# EAGLE design 01072016wearable_v1.3 - OK (EAGLE 7.6.0)
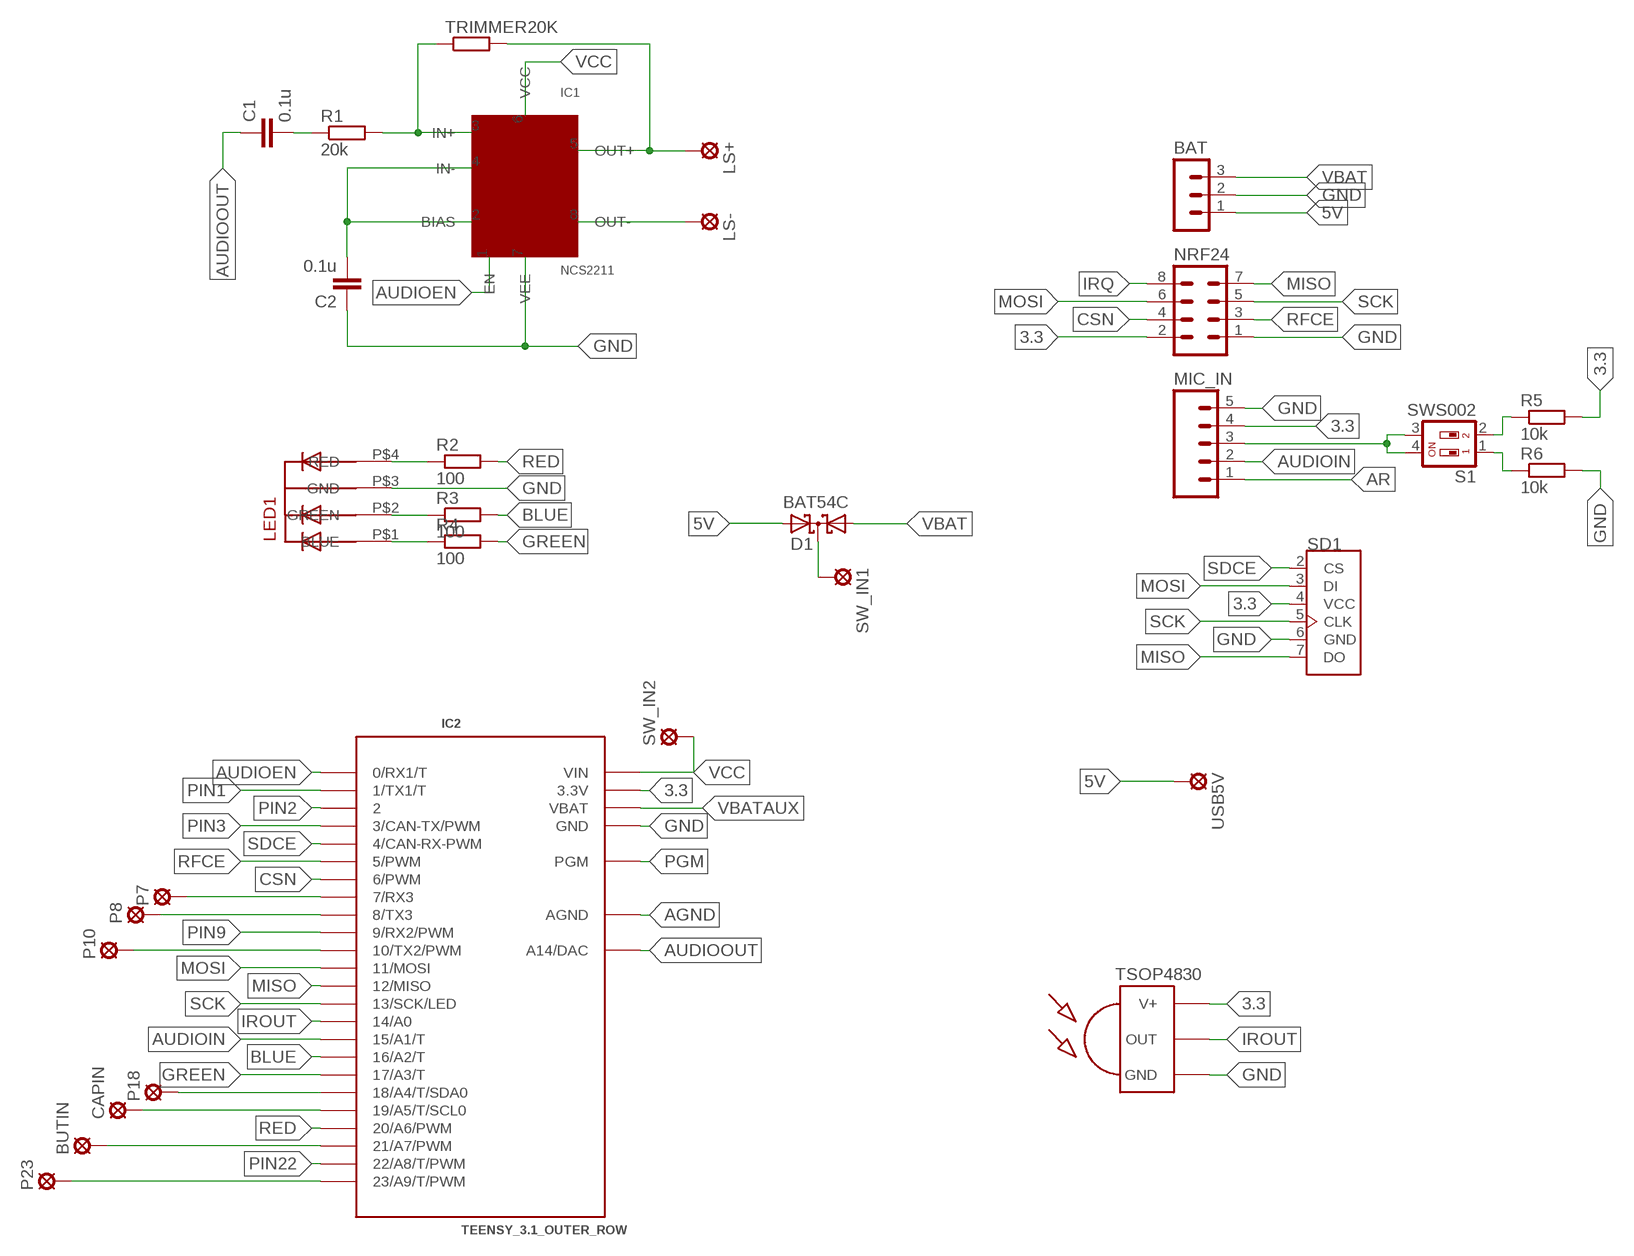
[diagram p0: schematic, sheet 1]

## Parts
BAT  MA03-1  [MA03-1]
BUTIN  LSP10  [LSP10]
C1  0.1u  C2.5/2  [C2.5-2]
C2  0.1u  C2.5/2  [C2.5-2]
CAPIN  LSP10  [LSP10]
D1  BAT54C  [SOT23]
IC1  NCS2211  [SOIC-8]
IC2  TEENSY_3.1_OUTER_ROW  [TEENSY3-OUTER_ROW]
LED1  5MMRGBLED  [LED5MMRGB]
LS+  LSP10  [LSP10]
LS-  LSP10  [LSP10]
MIC_IN  MA05  [05PA]
NRF24  MA04-2  [MA04-2]
P7  LSP10  [LSP10]
P8  LSP10  [LSP10]
P10  LSP10  [LSP10]
P18  LSP10  [LSP10]
P23  LSP10  [LSP10]
R1  20k  R-EU_0204/7  [0204/7]
R2  100  R-EU_0207/2V  [0207/2V]
R3  100  R-EU_0207/2V  [0207/2V]
R4  100  R-EU_0207/2V  [0207/2V]
R5  10k  R-EU_0207/2V  [0207/2V]
R6  10k  R-EU_0207/2V  [0207/2V]
S1  SWS002  [SMS-002]
SD1  MICROSD_SF-MICROSD  [MICROSD_MICROSD]
SW_IN1  SE11  [SE11]
SW_IN2  SE11  [SE11]
TRIMMER20K  R-EU_0207/2V  [0207/2V]
U$1  TSOP4830  [TSOP18XX]
USB5V  LSP10  [LSP10]

## Nets
3.3 [3.3]: IC2.3.3V IC2.3.3V1(3.3V) MIC_IN.4 NRF24.2 R5.2 SD1.4(VCC) U$1.VCC(V+)
5V [3.3]: BAT.1 D1.2(A2) USB5V.MP
AGND: IC2.AGND
AR: MIC_IN.1
AUDIOEN: IC1.1(EN) IC2.0(0/RX1/T)
AUDIOIN: IC2.15/A1(15/A1/T) MIC_IN.2
AUDIOOUT: C1.1 IC2.RESET/DAC(A14/DAC)
BLUE: IC2.16/A2(16/A2/T) R3.2
CSN: IC2.6(6/PWM) NRF24.4
GAIN: MIC_IN.3 S1.3 S1.4
GND [GND]: BAT.2 C2.1 IC1.7(VEE) IC2.GND IC2.GND1(GND) LED1.P$3(GND) MIC_IN.5 NRF24.1 R6.2 SD1.6(GND) U$1.GND
GREEN: IC2.17/A3(17/A3/T) R4.2
IROUT: IC2.14/A0 U$1.OUT
IRQ: NRF24.8
MISO: IC2.12(12/MISO) NRF24.7 SD1.7(DO)
MOSI: IC2.11(11/MOSI) NRF24.6 SD1.3(DI)
N$1: D1.3(CC) SW_IN1.MP
N$2: IC1.5(OUT+) LS+.MP TRIMMER20K.2
N$3: IC1.3(IN+) R1.2 TRIMMER20K.1
N$4: C1.2 R1.1
N$5: C2.2 IC1.2(BIAS) IC1.4(IN-)
N$6: IC1.8(OUT-) LS-.MP
N$7: LED1.P$4(RED) R2.1
N$8: LED1.P$1(BLUE) R4.1
N$9: LED1.P$2(GREEN) R3.1
N$10: BUTIN.MP IC2.21/A7(21/A7/PWM)
N$11: R5.1 S1.2
N$12: R6.1 S1.1
PGM: IC2.PGM
PIN1: IC2.1(1/TX1/T)
PIN2: IC2.2
PIN3: IC2.3(3/CAN-TX/PWM)
PIN7: IC2.7(7/RX3) P7.MP
PIN8: IC2.8(8/TX3) P8.MP
PIN9: IC2.9(9/RX2/PWM)
PIN10: IC2.10(10/TX2/PWM) P10.MP
PIN18: IC2.18/A4(18/A4/T/SDA0) P18.MP
PIN19: CAPIN.MP IC2.19/A5(19/A5/T/SCL0)
PIN22: IC2.22/A8(22/A8/T/PWM)
PIN23: IC2.23/A9(23/A9/T/PWM) P23.MP
RED: IC2.20/A6(20/A6/PWM) R2.2
RFCE: IC2.5(5/PWM) NRF24.3
SCK: IC2.13(13/SCK/LED) NRF24.5 SD1.5(CLK)
SDCE: IC2.4(4/CAN-RX-PWM) SD1.2(CS)
VBAT [3.3]: BAT.3 D1.1(A1)
VBATAUX: IC2.VBAT
VCC: IC1.6(VCC) IC2.VIN SW_IN2.MP

## Library data of the parts
BAT = con-lstb:MA03-1: PIN HEADER; OC_FARNELL: unknown; OC_NEWARK: unknown
BUTIN CAPIN LS+ LS- P7 P8 P10 P18 P23 USB5V = solpad:LSP10: SOLDER PAD drill 1.0 mm, distributor Buerklin, 12H555
C1 C2 = capacitor-wima:C: CAPACITOR naming: grid - package width
D1 = diode:BAT54C: Schottky Diodes Source: Fairchild .. BAT54.pdf
IC1 = NCS2211:NCS2211
IC2 = Teensy_3_and_LC_Series_Boards_v1.1:TEENSY_3.1_OUTER_ROW: Footprint for Teensy 3.1 or 3.2 board using all pin connections on the outer perimeter
LED1 = led_rgb:5MMRGBLED
MIC_IN = con-amp-quick:MA05: AMP QUICK CONNECTOR; OC_FARNELL: unknown; OC_NEWARK: unknown
NRF24 = con-lstb:MA04-2: PIN HEADER; OC_FARNELL: unknown; OC_NEWARK: unknown
R1-R6 TRIMMER20K = rcl:R-EU_: RESISTOR, European symbol
S1 = smd-special:SWS002: SMD Dip Switch 2 pol.
SD1 = sd:MICROSD_SF-MICROSD
SW_IN1 SW_IN2 = solpad:SE11: SOLDER PAD RTM, drill 1,1mm, distributor Buerklin, 07F810
U$1 = tsop-1:TSOP4830: IR Receiver and Demodulator

## Net classes
0 default: width 0.61 mm, clearance 0.3 mm
1 GND: width 0.61 mm, clearance 0.3 mm
2 3.3: width 0.61 mm, clearance 0.3 mm

## Board
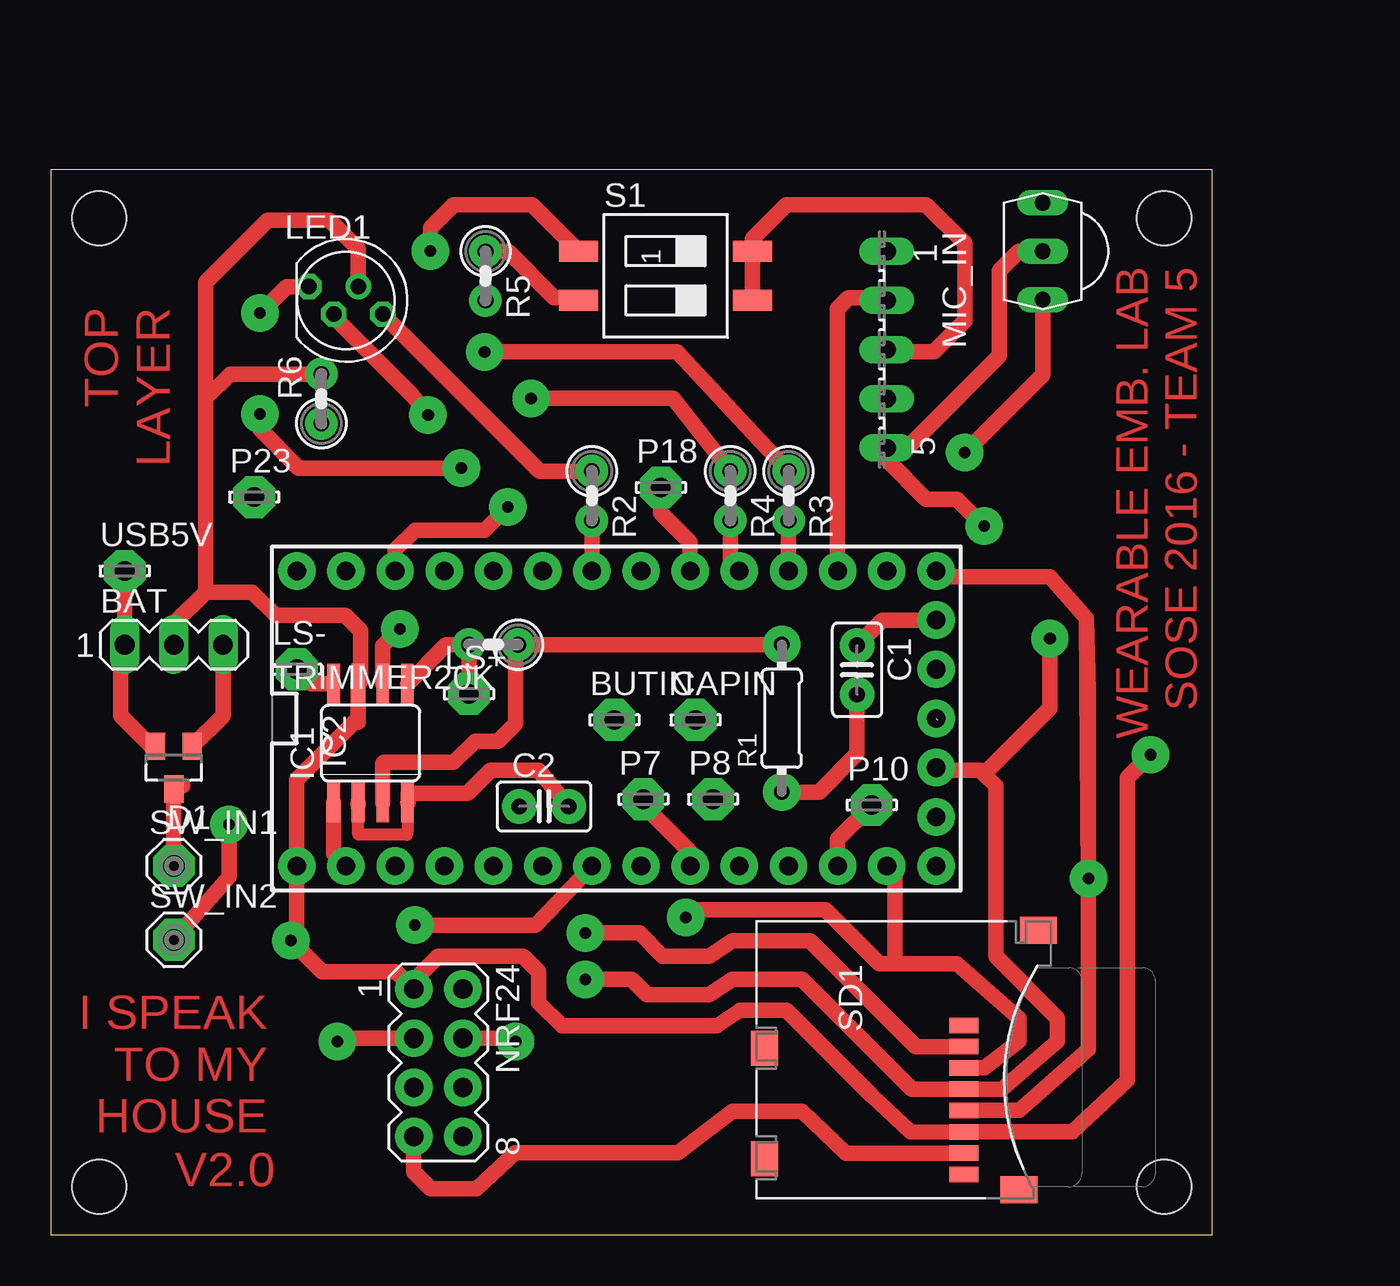
[diagram p1: board, top side]
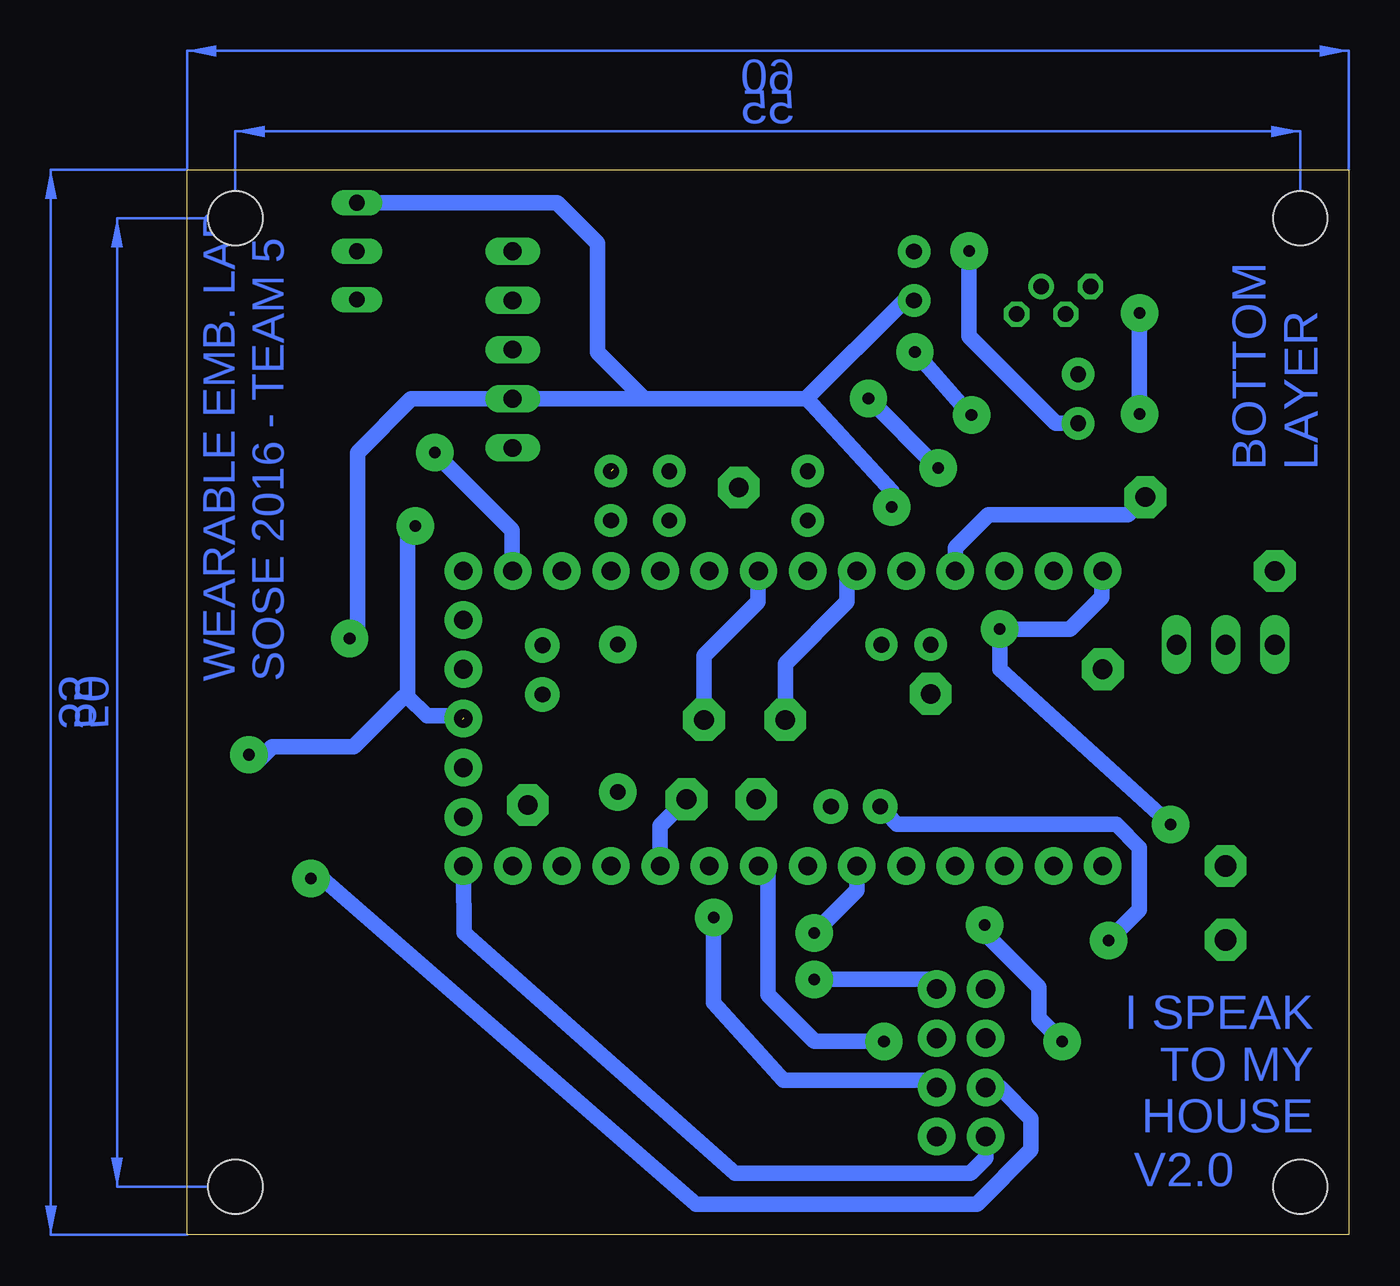
[diagram p2: board, bottom side, seen from below]

Size 60 x 55 mm. Coordinates in mm from the lower left corner, seen from the top.
Outline: 0,0 60,0 60,55 0,55 0,0
Copper layers (1*16): Top 0.035mm / dielectric 1.5mm / Bottom 0.035mm
Design rules "default *": minimum track width 10mil, minimum drill 24mil, track to track 0.2mm, track to pad 0.2mm, pad to pad 0.2mm, via to via 0.2mm, smd to smd 0.2mm, copper to edge 40mil, drill to drill 8mil, minimum pad ring 10mil, minimum via ring 8mil, stop-mask expansion 4mil, vias tented up to drill 0mil, thermal gap 10mil
Holes 2.8 mm at 2.5,2.5 2.5,52.5 57.5,52.5 57.5,2.5

### Footprints (pad centres in the part's own frame; a part is rotated, then mirrored left to right if it is on the bottom)
MA03-1 = drill 1.016 long: 1 -2.54,0; 2 0,0; 3 2.54,0
LSP10 = drill 1.016 pad 2.159 octagon: MP 0,0
C2.5-2 = drill 0.813 pad 1.778: 1 -1.27,0; 2 1.27,0
SOT23 = smd 1 x 1.4: 1 -0.95,-1.1; 2 0.95,-1.1; 3 0,1.1
SOIC-8 = smd 0.66 x 2.032: 1 -1.905,-3.073; 2 -0.635,-3.073; 3 0.635,-3.073; 4 1.905,-3.073; 5 1.905,3.073; 6 0.635,3.073; 7 -0.635,3.073; 8 -1.905,3.073
TEENSY3-OUTER_ROW = drill 0.965 pad 1.93: 0 -7.62,13.97; 1 -7.62,11.43; 2 -7.62,8.89; 3 -7.62,6.35; 3.3V 7.62,11.43; 3.3V1 -2.54,-16.51; 4 -7.62,3.81; 5 -7.62,1.27; 6 -7.62,-1.27; 7 -7.62,-3.81; 8 -7.62,-6.35; 9 -7.62,-8.89; 10 -7.62,-11.43; 11 -7.62,-13.97; 12 -7.62,-16.51; 13 7.62,-16.51; 14/A0 7.62,-13.97; 15/A1 7.62,-11.43; 16/A2 7.62,-8.89; 17/A3 7.62,-6.35; 18/A4 7.62,-3.81; 19/A5 7.62,-1.27; 20/A6 7.62,1.27; 21/A7 7.62,3.81; 22/A8 7.62,6.35; 23/A9 7.62,8.89; AGND 7.62,13.97; GND -7.62,16.51; GND1 0,-16.51; PGM 2.54,-16.51; RESET/DAC 5.08,-16.51; VBAT -5.08,-16.51; VIN 7.62,16.51
LED5MMRGB = drill 0.8 pad 0.813 octagon: P$1 -1.905,0.714; P$2 -0.635,-0.714; P$4 1.905,-0.714 | drill 0.8 pad 0.813: P$3 0.635,0.714
05PA = drill 0.914 long: 1 -5.08,0; 2 -2.54,0; 3 0,0; 4 2.54,0; 5 5.08,0
MA04-2 = drill 1.016 pad 1.93: 1 -3.81,-1.27; 2 -3.81,1.27; 3 -1.27,-1.27; 4 -1.27,1.27; 5 1.27,-1.27; 6 1.27,1.27; 7 3.81,-1.27; 8 3.81,1.27
0204/7 = drill 0.813 pad 1.93: 1 -3.81,0; 2 3.81,0
0207/2V = drill 0.813 pad 1.676: 1 -1.27,0; 2 1.27,0
SMS-002 = smd 1.092 x 2.007: 1 -1.27,-4.496; 2 1.27,-4.496; 3 1.27,4.496; 4 -1.27,4.496
MICROSD_MICROSD = smd 0.8 x 1.5: 1 -1.94,2.7; 2 -0.84,2.7; 3 0.26,2.7; 4 1.36,2.7; 5 2.46,2.7; 6 3.56,2.7; 7 4.66,2.7; 8 5.76,2.7 | smd 1.4 x 1.9: NC -6.85,6.55; NC3 6.55,5.55 | smd 1.8 x 1.4: NC1 -0.75,-7.6; NC2 4.95,-7.6
SE11 = drill 1.118 pad 2.159 octagon: MP 0,0
TSOP18XX = drill 0.813 long: GND -0.001,-0.027; OUT -2.501,-0.027; VCC 2.499,-0.027

### Placement (x,y rotation side)
BAT  6.35,30.48 0 top
BUTIN  29.1,26.6 0 top
C1  41.64,29.18 270 top
C2  25.47,22.13 0 top
CAPIN  33.3,26.6 0 top
D1  6.35,24.13 180 top
IC1  16.51,25.4 0 top
IC2  29.21,26.67 90 top
LED1  15.24,48.26 0 top
LS+  21.59,27.94 0 top
LS-  12.7,29.21 0 top
MIC_IN  43.18,45.72 270 top
NRF24  20.01,8.89 270 top
P7  30.6,22.5 0 top
P8  34.2,22.5 0 top
P10  42.4,22.2 0 top
P18  31.5,38.6 0 top
P23  10.5,38.1 0 top
R1  37.75,26.68 90 top
R2  27.94,38.17 270 top
R3  38.1,38.17 270 top
R4  35.09,38.17 270 top
R5  22.45,49.52 270 top
R6  13.97,43.18 90 top
S1  31.75,49.53 270 top
SD1  44.45,8.89 270 top
SW_IN1  6.35,19.05 0 top
SW_IN2  6.35,15.24 0 top
TRIMMER20K  22.86,30.48 180 top
U$1  51.2,50.8 90 top
USB5V  3.81,34.29 0 top

### Tracks (layer width: path | path; a pad name or v marks a point on that pad's centre or on a via)
3.3  (via drill 0.6 pad 1.93)
  Top 0.813: IC2.3.3V 17.78,35.38 18.8,36.4 22.4,36.4 v23.6,37.6 | 48.2,23.8 48.8,23.2 48.8,14.4 52,11.2 52,10 49.13,7.53 SD1.4 44.47,7.53 38.8,13.2 35.2,13.2 34,12.4 30.8,12.4 30,13.2 v27.6,13.2 | 48.2,23.8 48,24 45.85,24 IC2.3.3V1 | v51.6,30.8 51.6,27.2 48.2,23.8
  Bottom 0.813: v23.6,37.6 23.6,38.4 28,43.2 | 28,43.2 22.95,48.25 R5.2 | 28,43.2 28.02,43.18 36.4,43.18 | 36.4,43.18 MIC_IN.4 48.42,43.18 51.2,40.4 51.2,31.2 v51.6,30.8 | v27.6,13.2 21.78,13.2 NRF24.2 | U$1.VCC 40.9,53.3 38.8,51.2 38.8,45.58 36.4,43.18
5V
  Top 0.813: D1.2 5.17,25.23 3.6,26.8 3.6,30.27 BAT.1 USB5V.MP
AUDIOEN
  Top 0.813: IC1.1 14.61,19.68 IC2.0
AUDIOIN
  Top 0.813: IC2.15/A1 40.64,47.84 41.2,48.4 43.04,48.4 MIC_IN.2
AUDIOOUT
  Top 0.813: C1.1 42.94,31.75 IC2.RESET/DAC
BLUE
  Top 0.813: R3.2 IC2.16/A2
CSN  (via drill 0.6 pad 1.93)
  Top 0.813: v24,10 24.24,10.16 NRF24.4
  Bottom 0.813: v24,10 27.6,10 30,12.4 30,18.57 IC2.6
GAIN
  Top 0.813: S1.4 S1.3 36.25,51.45 38,53.2 45.2,53.2 47.2,51.2 47.2,47.2 45.6,45.6 43.3,45.6 MIC_IN.3
GND  (via drill 0.6 pad 1.93)  (1 unrouted)
  Top 0.813: BAT.2 6.35,31.55 8,33.2 | 8,33.2 10.4,33.2 11.6,32 15.2,32 16,31.2 16,28.6 IC1.7 15.88,26.48 15.8,26.6 12.7,23.5 IC2.GND 12.7,15.5 v12.4,15.2 14,13.6 17.84,13.6 NRF24.1 18.74,13.14 20,14.4 24.4,14.4 25.2,13.6 25.2,12 26.4,10.8 34.4,10.8 35.6,11.6 38,11.6 42.4,7.2 44.39,5.33 47.47,5.31 SD1.6 52.76,5.33 55.6,8 55.6,23.6 v56.8,24.8 | LED1.P$3 15.88,50.92 14.4,52.4 11.2,52.4 8,49.2 8,43.2 | 8,43.2 8,33.2 | R6.2 9.25,44.45 8,43.2 | U$1.GND 50,50.8 49,49.8 49,45.4 44.4,40.8 43.34,40.8 MIC_IN.5 43.18,40.02 45.2,38 46.8,38 v48.2,36.6
  Bottom 0.813: C2.1 23.33,21.2 12,21.2 10.8,20 10.8,16.8 v12.4,15.2 | 45.87,26.67 45.8,26.6 | v48.2,36.6 48.6,36.2 48.6,27.8 | 48.6,27.8 47.6,26.8 45.85,26.8 IC2.GND1 | 48.6,27.8 48.8,27.8 51.4,25.2 55.6,25.2 56.4,24.4 v56.8,24.8
GREEN
  Top 0.813: R4.2 35.09,34.76 IC2.17/A3
IROUT  (via drill 0.6 pad 1.93)
  Top 0.813: U$1.OUT 51.23,44.43 v47.2,40.4
  Bottom 0.813: v47.2,40.4 43.2,36.4 43.2,34.31 IC2.14/A0
MISO
  Top 0.813: NRF24.7 18.74,3.26 19.6,2.4 22,2.4 23.98,4.25 32.4,4.25 35.2,6.4 38.8,6.4 41.06,4.23 SD1.7
  Bottom 0.813: IC2.12 45.72,18.68 45.7,15.6 31.7,3.2 19.54,3.2 18.74,4 NRF24.7
MOSI  (via drill 0.6 pad 1.93)
  Top 0.813: SD1.3 48.23,8.63 50,10 50,11.2 46.8,14 43.6,14 | 43.6,14 43.6,18.63 IC2.11 | 43.6,14 42.8,14 40,16.8 33.2,16.8 v32.8,16.4
  Bottom 0.813: v32.8,16.4 32.8,12 29.2,8 21.66,8 NRF24.6
N$1
  Top 0.813: 6.8,23.2 6.52,23.2 D1.3 SW_IN1.MP
N$2
  Top 0.813: IC1.5 20.42,30.48 TRIMMER20K.2 LS+.MP
N$3
  Top 0.813: IC1.3 17.14,24.34 17.2,24.4 20.8,24.4 21.9,25.5 23.1,25.5 24,26.4 24,30.35 TRIMMER20K.1 R1.2
N$4
  Top 0.813: R1.1 39.67,22.87 41.64,24.84 C1.2
N$5
  Top 0.61: IC1.4 18.41,20.82 18.38,20.66 15.87,20.67 15.88,22.18
  Top 0.813: IC1.4 18.44,22.33 18.44,22.82 21.53,22.82 22.71,24 25.2,24 C2.2 | 15.88,22.18 IC1.2
N$6
  Top 0.813: LS-.MP 13.44,28.47 IC1.8
N$7
  Top 0.813: R2.1 25.25,39.44 LED1.P$4
N$8  (via drill 0.6 pad 1.93)
  Top 0.813: LED1.P$1 12.17,48.97 v10.8,47.6 | v10.8,42.4 10.8,41.6 12.8,39.6 v21.2,39.6 | v24.8,43.2 32.13,43.2 R4.1
  Bottom 0.813: v10.8,47.6 v10.8,42.4 | v21.2,39.6 v24.8,43.2
N$9  (via drill 0.6 pad 1.93)  (1 unrouted)
  Top 0.813: LED1.P$2 14.61,47.41 18.65,43.36 19.45,42.37 v19.48,42.34 | v22.4,45.6 32.34,45.6 R3.1
  Bottom 0.813: v19.48,42.34 19.54,42.34 v22.4,45.6
N$10
  Bottom 0.813: IC2.21/A7 25.9,33.79 25.9,32.7 29.1,29.5 BUTIN.MP
N$11
  Top 0.813: 27.16,48.35 S1.2 27.11,48.4 26,48.4 23.61,50.79 R5.1
N$12  (via drill 0.6 pad 1.93)
  Top 0.813: v19.6,50.8 19.6,52 20.8,53.2 24.85,53.2 S1.1
  Bottom 0.813: R6.1 15.11,41.91 19.6,46.4 v19.6,50.8
PIN7
  Top 0.813: IC2.7 33.02,19.78 31.1,21.7 31.1,22 P7.MP
PIN8
  Bottom 0.813: IC2.8 35.56,21.14 P8.MP
PIN10
  Top 0.813: P10.MP 40.64,20.44 IC2.10
PIN18
  Top 0.813: P18.MP 31.5,37.3 33.02,35.78 IC2.18/A4
PIN19
  Bottom 0.813: IC2.19/A5 30.5,34.27 30.5,32.7 33.3,29.9 CAPIN.MP
PIN23
  Bottom 0.813: P23.MP 11.4,37.2 18.6,37.2 20.32,35.48 IC2.23/A9
RED
  Top 0.813: R2.2 IC2.20/A6
RFCE  (via drill 0.6 pad 1.93)
  Top 0.813: IC2.5 25.04,16 v18.8,16 | v14.8,10 14.96,10.16 NRF24.3
  Bottom 0.813: v18.8,16 18.8,15.6 16,12.8 16,11.2 v14.8,10
SCK  (via drill 0.6 pad 1.93)
  Top 0.813: IC2.13 46.01,34 51.6,34 53.48,31.85 | 53.48,31.85 v53.6,18.4 | v53.6,18.4 53.6,9.6 50.03,6.43 SD1.5 | v53.6,18.4 53.6,28.13 53.48,31.85
  Bottom 0.813: NRF24.5 18.02,7.62 16.4,6 16.4,4.4 19.2,1.6 33.7,1.6 53,18.4 v53.6,18.4
SDCE  (via drill 0.6 pad 1.93)
  Top 0.813: v27.6,15.6 30.4,15.6 31.6,14.4 34,14.4 35.2,15.2 39.2,15.2 44.69,9.73 SD1.2
  Bottom 0.813: IC2.4 25.4,17.8 v27.6,15.6
VBAT
  Top 0.813: BAT.3 8.89,26.82 D1.1
VCC  (via drill 0.6 pad 1.93)
  Top 0.813: IC1.6 17.14,30.41 v18.02,31.29 | SW_IN2.MP 9.2,18.49 v9.2,21.2
  Bottom 0.813: IC2.VIN 12.75,34.24 12.75,32.93 14.39,31.29 v18.02,31.29 18.02,29.22 v9.2,21.2
(copper drawn outside any net)
  shapes: Bottom area x4

### Text on the board
Top: WEARABLE EMB. LAB / SOSE 2016 - TEAM 5 | TOP / LAYER | I SPEAK / TO MY / HOUSE | V2.0
Bottom: BOTTOM / LAYER | WEARABLE EMB. LAB / SOSE 2016 - TEAM 5 | I SPEAK / TO MY / HOUSE | V2.0